# Altium schematic sheet Sensor.SchDoc
size 101 x 55 mm
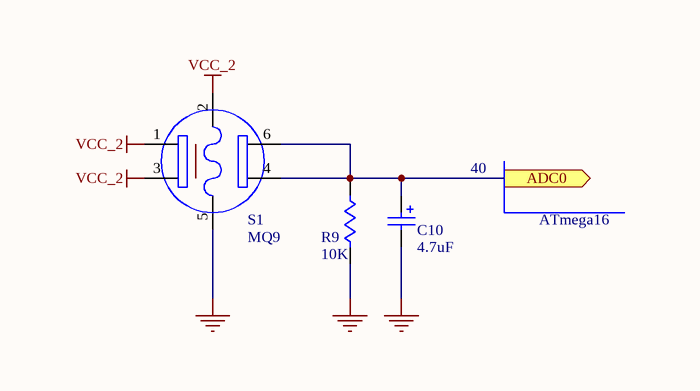
[diagram p0: Sensor.SchDoc]

## Parts
C10  value 4.7uF  [RB_3.175mm]  (hidden comment: Capacitor_1)
R9  value 10K  [AXIAL0.4]  (hidden comment: Resistor)
S1  value MQ9  [MQ]  (hidden comment: MQ)

## Ports
ADC0 (out)

## Nets
GND: C10.2 R9.2 S1.5
VCC_2: S1.1 S1.2 S1.3
ADC0: C10.1 R9.1 S1.4 S1.6 ; port ADC0

## Notes on the sheet
- 40
- ATmega16

## Library data of the parts
C10 = Capacitor_1: Polarized Capacitor (Radial); Manufacturer: Generic Components; Class I: Passive; Published: 8-Jun-2000; Revision: July-2002: Re-released for DXP Platform.; Publisher: Altium Limited; Class II: Capacitor
R9 = Resistor: Manufacturer: Generic Components; Revision: July-2002: Re-released for DXP Platform.; Publisher: Altium Limited
S1 = MQ: Gas Sensor; Manufacturer: Generic Components; Class I: Passive; Class II: Inductor; Published: 8-Jun-2000; Revision: July-2002: Re-released for DXP Platform.; Publisher: Altium Limited